# EAGLE design CanduinoV2 (EAGLE 5.07)
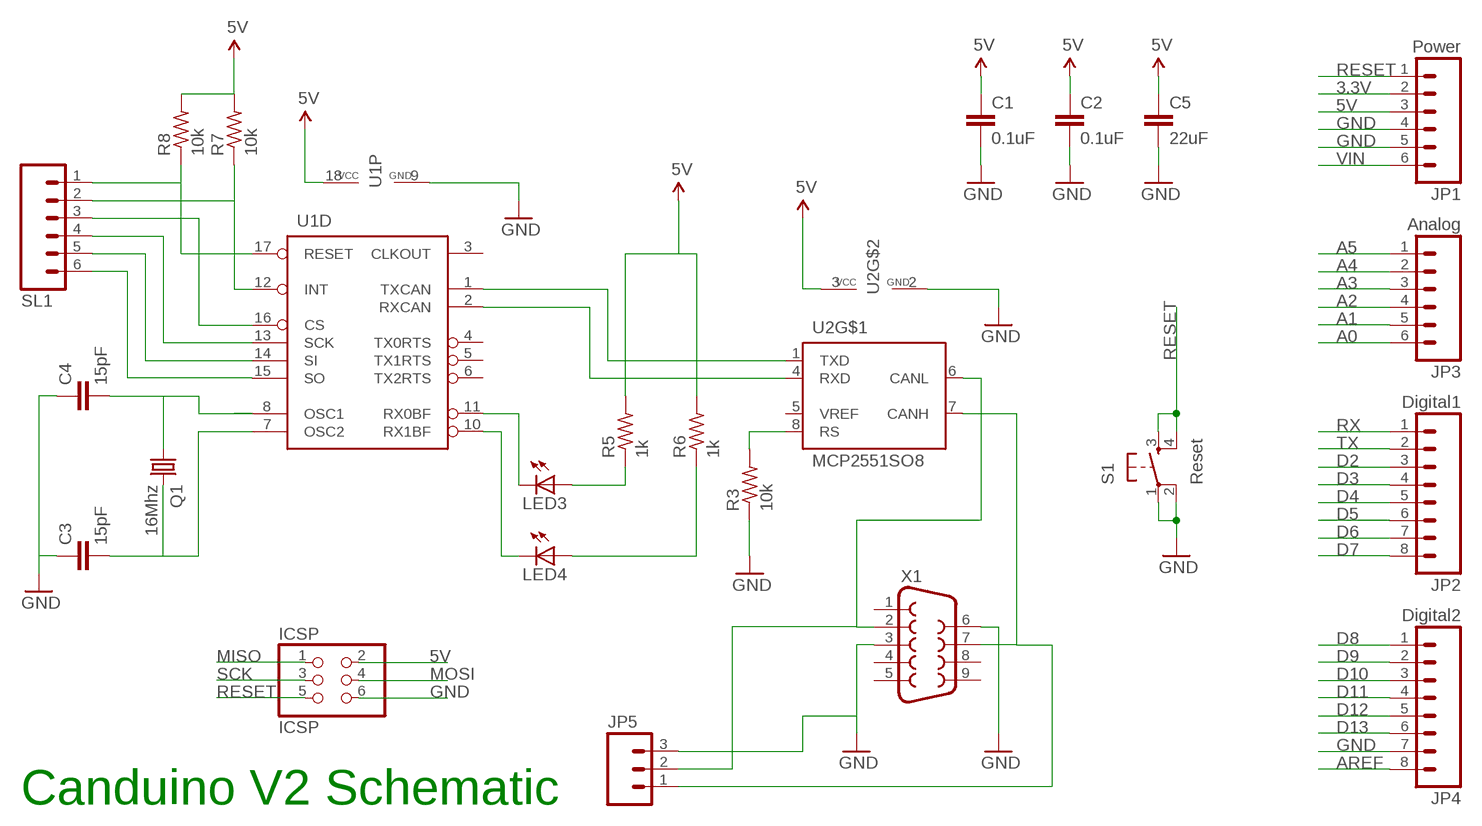
[diagram p0: schematic, sheet 1]

## Parts
C1  0.1uF  CAP0805  [0805]
C2  0.1uF  CAP0805  [0805]
C3  15pF  C-EUC0805  [C0805]
C4  15pF  C-EUC0805  [C0805]
C5  22uF  CAP0805  [0805]
ICSP  ICSP  PINHD-2X3  [2X03]
JP1  Power  M06SIP  [1X06]
JP2  Digital1  M08  [1X08]
JP3  Analog  M06SIP  [1X06]
JP4  Digital2  M08  [1X08]
JP5  M03SCREW  [SCREWTERMINAL-3.5MM-3]
LED3  LED0603  [LED-0603]
LED4  LED0603  [LED-0603]
Q1  16Mhz  CRYSTALHC49S  [HC49/S]
R3  10k  R-US_R0805  [R0805]
R5  1k  R-US_R0805  [R0805]
R6  1k  R-US_R0805  [R0805]
R7  10k  R-US_R0805  [R0805]
R8  10k  R-US_R0805  [R0805]
S1  Reset  TAC_SWITCHSMD  [TACTILE_SWITCH_SMD]
SL1  M06SIP  [1X06]
U1  MCP2515SO  [SO-18W]
U2  MCP2551SO8  [SO08]
X1  DB9  [DB9]

## Nets
3.3V: JP1.2
5V [power]: C1.1 C2.1 ICSP.2 JP1.3 U2.3(VCC)
A0: JP3.6
A1: JP3.5
A2: JP3.4
A3: JP3.3
A4: JP3.2
A5: JP3.1
AREF: JP4.8
D2: JP2.3
D3: JP2.4
D4: JP2.5
D5: JP2.6
D6: JP2.7
D7: JP2.8
D8: JP4.1
D9: JP4.2
D10: JP4.3
D11: JP4.4
D12: JP4.5
D13: JP4.6
GND [power]: C1.2 C2.2 C3.1 C4.1 C5.2 ICSP.6 JP1.4 JP1.5 JP4.7 JP5.3 R3.1 S1.1 S1.2 U1.9(P:GND) U2.2(GND) X1.3 X1.6
MISO: ICSP.1
MOSI: ICSP.4
N$1: U1.1(D:TXCAN) U2.1(TXD)
N$3: U1.2(D:RXCAN) U2.4(RXD)
N$4: LED4.C U1.10(D:RX1BF)
N$5: C4.2 Q1.1 U1.8(D:OSC1)
N$10: R3.2 U2.8(RS)
N$11: C3.2 Q1.2 U1.7(D:OSC2)
N$12: LED3.C U1.11(D:RX0BF)
N$13: LED3.A R5.1
N$14: LED4.A R6.1
N$16: JP5.1 U2.7(CANH) X1.7
N$17: JP5.2 U2.6(CANL) X1.2
N$18: R7.1 SL1.2 U1.12(D:INT)
N$19: R8.1 SL1.1 U1.17(D:RESET)
N$20: SL1.5 U1.14(D:SI)
N$21: SL1.4 U1.13(D:SCK)
N$22: SL1.6 U1.15(D:SO)
N$23: SL1.3 U1.16(D:CS)
RESET: ICSP.5 JP1.1 S1.3 S1.4
RX: JP2.1
SCK: ICSP.3
TX: JP2.2
VCC: C5.1 R5.2 R6.2 R7.2 R8.2 U1.18(P:VCC) ; supply symbol labelled 5V
VIN [power]: JP1.6
Unconnected: U1.3(D:CLKOUT) U1.4(D:TX0RTS) U1.5(D:TX1RTS) U1.6(D:TX2RTS) U2.5(VREF) X1.1 X1.4 X1.5 X1.8 X1.9

## Notes on the sheet
- Canduino V2 Schematic

## Library data of the parts
C1 C2 C5 = SparkFun:CAP: Capacitor Standard 0603 ceramic capacitor, and 0.1" leaded capacitor.
C3 C4 = resistor:C-EU: CAPACITOR, European symbol
ICSP = pinhead:PINHD-2X3: PIN HEADER
JP1 JP3 SL1 = SparkFun:M06: Header 6 Standard 6-pin 0.1" header. Use with straight break away headers (SKU : PRT-00116), right angle break away headers (PRT-00553), swiss pins (PRT-00743), machine pins (PRT-00117), and female headers (PRT-00115). Molex polarized connector foot print use with SKU : PRT-08094 with associated crimp pins and housings. NOTES ON THE VARIANTS LOCK and LOCK_LONGPADS... This footprint was designed to help hold the alignment of a through-hole component (i.e. 6-pin header) while soldering it into place. You may notice that each hole has been shifted either up or down by 0.005 of an inch from it's more standard position (which is a perfectly straight line). This slight alteration caused the pins (the squares in the middle) to touch the edges of the holes. Because they are alternating, it causes a "brace" to hold the component in place. 0.005 has proven to be the perfect amount of "off-center" position when using our standard breakaway headers. Although looks a little odd when you look at the bare footprint, once you have a header in there, the alteration is very hard to notice. Also, if you push a header all the way into place, it is covered up entirely on the bottom side. This idea of altering the position of holes to aid alignment will be further integrated into the Sparkfun Library for other footprints. It can help hold any component with 3 or more connection pins.
JP2 JP4 = SparkFun:M08: Header 8 Standard 8-pin 0.1" header. Use with straight break away headers (SKU : PRT-00116), right angle break away headers (PRT-00553), swiss pins (PRT-00743), machine pins (PRT-00117), and female headers (PRT-00115).
JP5 = SparkFun:M03: Header 3 Standard 3-pin 0.1" header. Use with straight break away headers (SKU : PRT-00116), right angle break away headers (PRT-00553), swiss pins (PRT-00743), machine pins (PRT-00117), and female headers (PRT-00115). Molex polarized connector foot print use with SKU : PRT-08232 with associated crimp pins and housings.
LED3 LED4 = SparkFun:LED: LEDs Standard schematic elements and footprints for 5mm, 3mm, 1206, and 0603 sized LEDs. 5mm - Spark Fun Electronics SKU : COM-00529 (and others)
Q1 = crystal:CRYSTAL: CRYSTAL
R3 R5-R8 = resistor:R-US_: RESISTOR, American symbol
S1 = SparkFun:TAC_SWITCH: Momentary Switch Button commonly used for reset or general input. Spark Fun Electronics SKU : COM-00097
U1 = can:MCP2515: MC2515 Stand-Alone CAN Controller With SPI Interface, Microchip
U2 = can:MCP2551: CAN Tranceiver Microchip
X1 = SparkFun:DB9: DB9 Connector Standard DB9 (D-Sub 9) serial connector. Can be used for CAN bus as well as RS485 and RS232. Footprint production proven. Spark Fun Electronics SKU : PRT-00429

## Net classes
1 power: width 0.254 mm

## Board
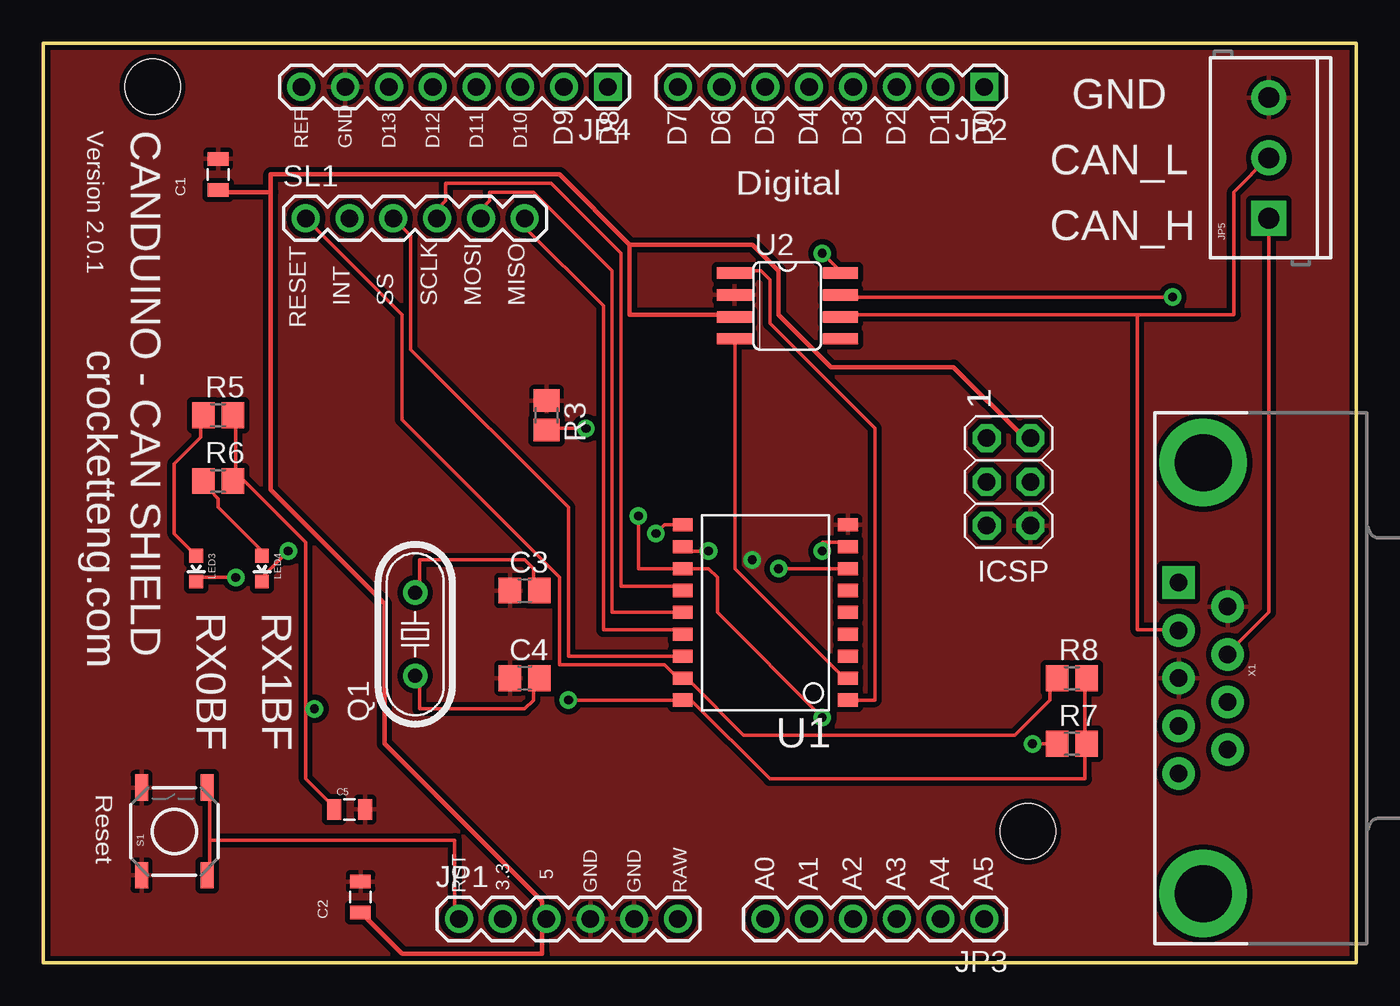
[diagram p1: board, top side]
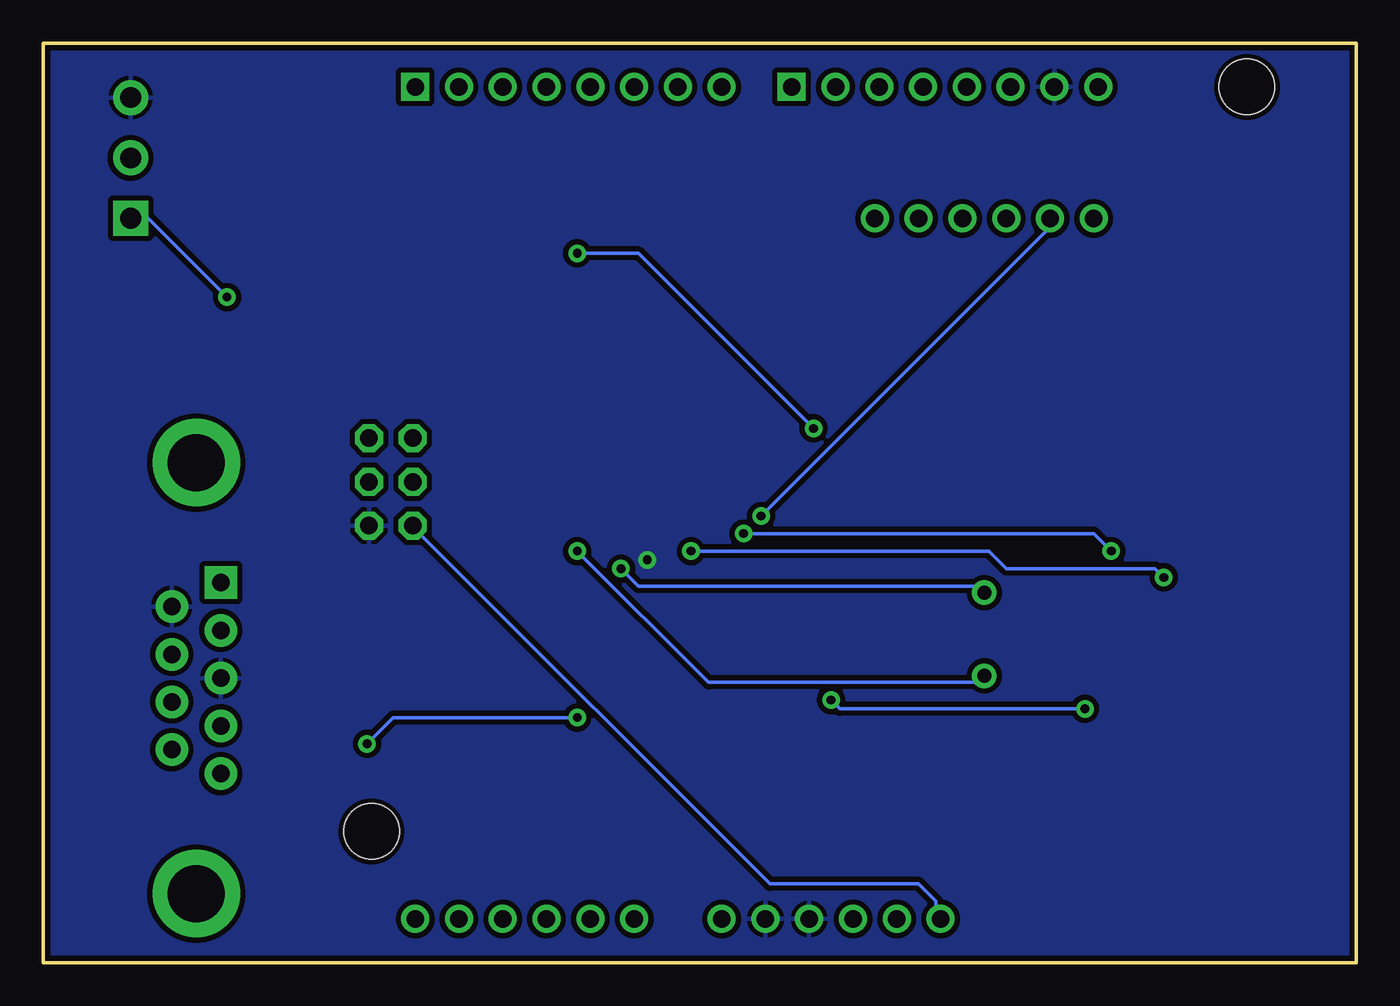
[diagram p2: board, bottom side, seen from below]

Size 76.2 x 53.34 mm. Coordinates in mm from the lower left corner, seen from the top.
Outline: 0,53.34 0,0 76.2,0 76.2,53.34 0,53.34
Copper layers (1*16): Top 0.035mm / dielectric 1.5mm / Bottom 0.035mm
Design rules "SparkFun": minimum track width 8mil, minimum drill 20mil, track to track 8mil, track to pad 8mil, pad to pad 8mil, via to via 8mil, smd to smd 8mil, copper to edge 10mil, drill to drill 8mil, minimum pad ring 12mil, minimum via ring 10mil, stop-mask expansion 4mil, vias tented up to drill 20mil, thermal gap 10mil
Holes 3.2 mm at 57.15,7.62 6.35,50.8

### Footprints (pad centres in the part's own frame; a part is rotated, then mirrored left to right if it is on the bottom)
0805 = smd 0.8 x 1.2: 1 -0.9,0; 2 0.9,0
C0805 = smd 1.3 x 1.5: 1 -0.85,0; 2 0.85,0
2X03 = drill 1.016 octagon: 1 -2.54,-1.27; 2 -2.54,1.27; 3 0,-1.27; 4 0,1.27; 5 2.54,-1.27; 6 2.54,1.27
1X06 = drill 1.016 round: 1 0,0; 2 2.54,0; 3 5.08,0; 4 7.62,0; 5 10.16,0; 6 12.7,0
1X08 = drill 1.016 square: 1 0,0 | drill 1.016 round: 2 2.54,0; 3 5.08,0; 4 7.62,0; 5 10.16,0; 6 12.7,0; 7 15.24,0; 8 17.78,0
SCREWTERMINAL-3.5MM-3 = drill 1.2 pad 2.032 square: 1 0,0 | drill 1.2 pad 2.032 round: 2 3.5,0; 3 7,0
LED-0603 = smd 0.8 x 0.8: A 0,-0.75; C 0,0.75
HC49/S = drill 0.813 round: 1 -2.413,0; 2 2.413,0
R0805 = smd 1.3 x 1.5: 1 -0.85,0; 2 0.85,0
TACTILE_SWITCH_SMD = smd 1.524 x 0.762: 1 -2.54,1.905; 2 2.54,1.905; 3 -2.54,-1.905; 4 2.54,-1.905
SO-18W = smd 0.762 x 1.143: 1 -5.08,-4.788; 2 -3.81,-4.788; 3 -2.54,-4.788; 4 -1.27,-4.788; 5 0,-4.788; 6 1.27,-4.788; 7 2.54,-4.788; 8 3.81,-4.788; 9 5.08,-4.788; 10 5.08,4.788; 11 3.81,4.788; 12 2.54,4.788; 13 1.27,4.788; 14 0,4.788; 15 -1.27,4.788; 16 -2.54,4.788; 17 -3.81,4.788; 18 -5.08,4.788
SO08 = smd 0.66 x 2.032: 1 -1.905,-3.073; 2 -0.635,-3.073; 3 0.635,-3.073; 4 1.905,-3.073; 5 1.905,3.073; 6 0.635,3.073; 7 -0.635,3.073; 8 -1.905,3.073
DB9 = drill 1.016 pad 1.88 square: 1 -5.54,-1.42 | drill 1.016 pad 1.88 round: 2 -2.77,-1.42; 3 0,-1.42; 4 2.77,-1.42; 5 5.54,-1.42; 6 -4.15,1.42; 7 -1.38,1.42; 8 1.38,1.42; 9 4.15,1.42 | drill 3.302 pad 5.08 round: G1 -12.5,0; G2 12.5,0

### Placement (x,y rotation side)
C1  10.16,45.72 90 top
C2  18.41,3.81 90 top
C3  27.94,21.59 0 top
C4  27.94,16.51 0 top
C5  17.78,8.89 0 top
ICSP  56.02,27.89 270 top
JP1  24.13,2.54 0 top
JP2  54.61,50.8 180 top
JP3  54.61,2.54 180 top
JP4  32.77,50.8 180 top
JP5  71.12,43.18 90 top
LED3  8.89,22.86 180 top
LED4  12.7,22.86 180 top
Q1  21.59,19.05 90 top
R3  29.21,31.75 270 top
R5  10.16,31.75 0 top
R6  10.16,27.94 0 top
R7  59.69,12.7 0 top
R8  59.69,16.51 0 top
S1  7.62,7.62 90 top
SL1  15.24,43.18 0 top
U1  41.91,20.32 90 top
U2  43.18,38.1 270 top
X1  67.31,16.51 270 top

### Tracks (layer width: path | path; a pad name or v marks a point on that pad's centre or on a via)
5V
  Top 0.254: 13.21,44.7 10.16,44.7 C1.1 | 13.21,44.7 13.21,27.43 19.81,20.83 19.81,12.7 28.96,3.56 28.96,2.54 | 28.96,2.54 28.96,0.51 20.83,0.51 18.8,2.54 C2.1 | 28.96,2.54 JP1.3 | 34.04,41.66 34.04,37.59 39.62,37.59 U2.3 | 34.04,41.66 29.97,45.72 13.21,45.72 13.21,44.7 | 34.04,41.66 41.15,41.66 42.67,40.13 42.67,37.59 45.72,34.54 52.83,34.54 56.9,30.48 ICSP.2
GND  (via drill 0.51)
  other vias: 41.15,23.37
  pour Bottom (isolate 0.305): 76.2,53.34 76.2,0 0,0 0,53.34
  pour Top (isolate 0.305): 76.2,53.34 76.2,0 0,0 0,53.34
N$1
  Top 0.203: U1.1 48.26,15.24 48.26,30.99 42.16,37.08 42.16,39.62 41.66,40.13 40.13,40.13 U2.1
N$3
  Top 0.203: U1.2 46.23,16.76 40.13,22.86 40.13,36.07 U2.4
N$4  (via drill 0.51)
  Top 0.203: v14.22,23.88 12.7,22.35 LED4.C | v35.56,24.89 36.07,25.4 U1.10
  Bottom 0.203: v14.22,23.88 15.24,24.89 v35.56,24.89
N$5  (via drill 0.51)
  Top 0.203: v45.21,23.88 45.21,24.38 46.23,24.38 U1.8 | C4.2 28.45,16.26 28.45,15.24 27.94,14.73 21.84,14.73 21.84,16.26 Q1.1
  Bottom 0.203: v45.21,23.88 37.59,16.26 21.84,16.26 Q1.1
N$10  (via drill 0.51)
  Top 0.203: v31.5,30.99 29.46,30.99 R3.2 | v45.21,41.15 46.23,40.13 U2.8
  Bottom 0.203: v31.5,30.99 41.66,41.15 v45.21,41.15
N$11  (via drill 0.51)
  Top 0.203: v42.67,22.86 U1.7 | C3.2 28.45,21.84 28.45,22.86 27.94,23.37 21.84,23.37 21.84,21.84 Q1.2
  Bottom 0.203: v42.67,22.86 41.66,21.84 21.84,21.84 Q1.2
N$12  (via drill 0.51)
  Top 0.203: v11.18,22.35 9.14,22.35 LED3.C | v38.61,23.88 37.59,23.88 U1.11
  Bottom 0.203: v11.18,22.35 11.68,22.86 20.32,22.86 21.34,23.88 v38.61,23.88
N$13
  Top 0.203: LED3.A 8.64,23.88 7.62,24.89 7.62,28.96 9.14,30.48 9.14,31.5 R5.1
N$14
  Top 0.203: LED4.A 12.7,23.88 10.16,26.42 10.16,26.92 9.65,27.43 9.65,27.94 R6.1
N$16  (via drill 0.51)
  Top 0.203: v65.53,38.61 46.74,38.61 U2.7 | JP5.1 71.12,20.32 69.09,18.29 X1.7
  Bottom 0.203: v65.53,38.61 70.1,43.18 JP5.1
N$17
  Top 0.203: 63.5,37.59 69.09,37.59 69.09,44.7 71.12,46.74 JP5.2 | 63.5,37.59 46.74,37.59 U2.6 | 63.5,37.59 63.5,19.3 65.53,19.3 X1.2
N$18  (via drill 0.51)
  Top 0.203: v34.54,25.91 34.54,22.86 U1.12 38.61,22.86 39.12,22.35 39.12,20.32 v45.21,14.22 | v57.4,12.7 R7.1
  Bottom 0.203: v34.54,25.91 17.78,42.67 SL1.2 | v57.4,12.7 55.88,14.22 v45.21,14.22
N$19
  Top 0.203: R8.1 58.42,16.26 58.42,15.24 56.39,13.21 40.64,13.21 37.59,16.26 U1.17 37.08,16.26 36.07,17.27 29.97,17.27 29.97,22.35 20.83,31.5 20.83,37.59 SL1.1
N$20
  Top 0.203: SL1.5 25.4,43.69 25.91,44.2 25.91,44.7 28.45,44.7 33.02,40.13 33.02,20.32 U1.14
N$21
  Top 0.203: SL1.4 22.86,43.69 23.37,44.2 23.37,45.21 29.46,45.21 33.53,41.15 33.53,21.84 37.08,21.84 U1.13
N$22
  Top 0.203: SL1.6 27.94,42.67 32.51,38.1 32.51,19.3 37.08,19.3 U1.15
N$23
  Top 0.203: SL1.3 21.34,42.16 21.34,35.56 30.48,26.42 30.48,17.78 U1.16
RESET
  Top 0.203: 9.65,7.11 9.65,10.16 S1.4 | 9.65,7.11 9.65,5.08 S1.3 | 9.65,7.11 23.88,7.11 23.88,2.54 JP1.1
  Bottom 0.203: ICSP.5 54.36,24.89 34.04,4.57 25.4,4.57 24.38,3.56 24.38,2.54 JP1.1
VCC  (via drill 0.51)
  Top 0.203: 60.45,12.7 60.45,10.67 42.16,10.67 37.59,15.24 U1.18 v30.48,15.24 | 60.45,12.7 60.45,16.26 R8.2 | 60.45,12.7 R7.2 | 15.24,14.73 15.24,24.38 11.18,28.45 | 15.24,14.73 15.24,10.67 16.76,9.14 C5.1 | 11.18,28.45 10.67,28.45 10.67,27.94 R6.2 11.18,28.45 | 11.18,28.45 11.18,31.5 R5.2 | 15.24,14.73 v15.75,14.73
  Bottom 0.203: v30.48,15.24 29.97,14.73 v15.75,14.73

### Text on the board
tPlace: GND | Version 2.0.1 | CANDUINO - CAN SHIELD | REF | GND | D13 | D12 | D11 | D10 | D9 | D8 | D7 | D6 | D5 | D4 | D3 | D2 | D1 | D0 | CAN_L | CAN_H | INT | SS | SCLK | MOSI | MISO | RESET | crocketteng.com | 1 | RX0BF | RX1BF | Reset | 5 | RST | 3.3 | GND | GND | RAW | A0 | A1 | A2 | A3 | A4 | A5
tNames: Digital